# EAGLE design gunboard (EAGLE 9.4.2)
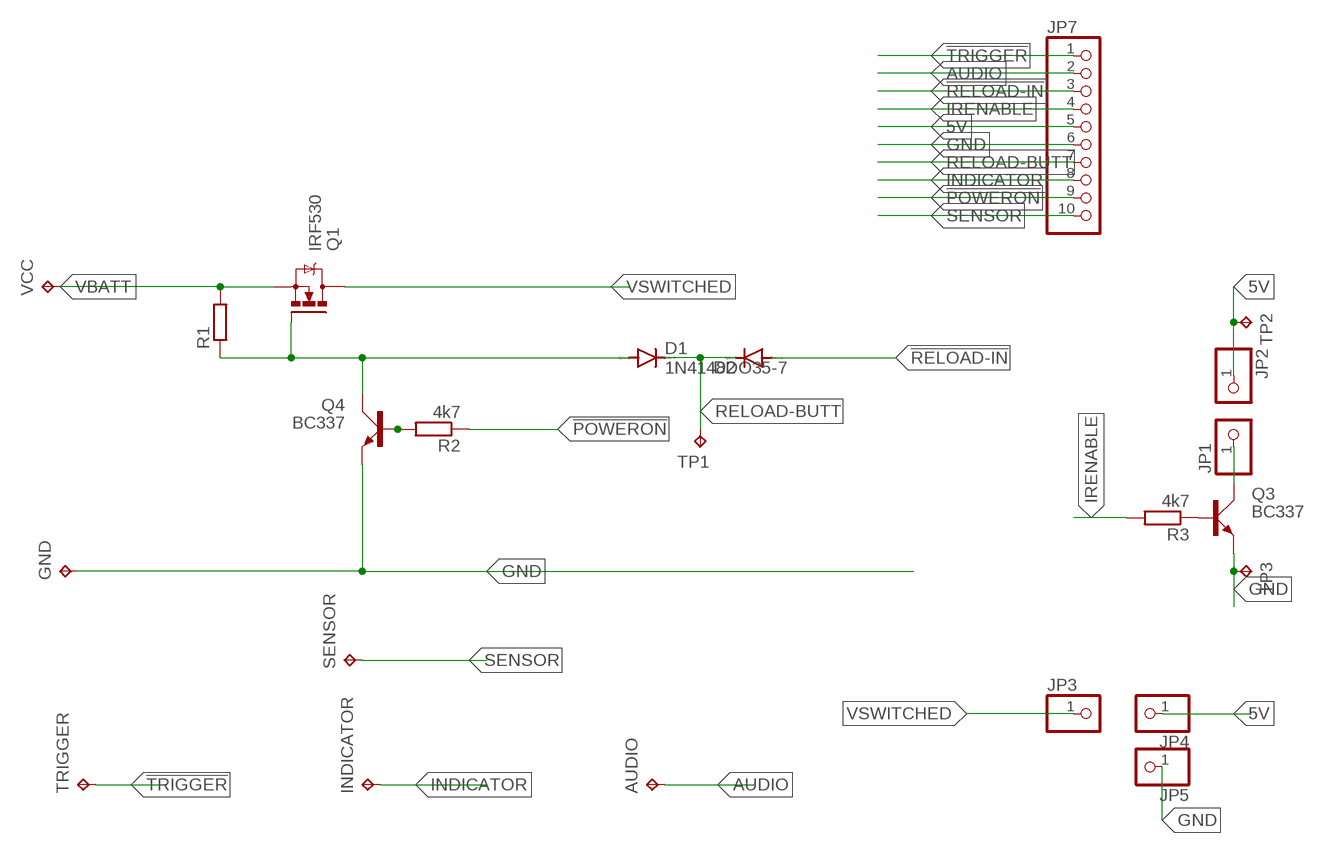
[diagram p0: schematic, sheet 1]

## Parts
AUDIO  TPTP20SQ  [TP20SQ]
D1  1N4148DO35-7  [DO35-7]
D2  DIODE-DO35-10  [DO35-10]
GND  TPTP20SQ  [TP20SQ]
INDICATOR  TPTP20SQ  [TP20SQ]
JP1  PINHD-1X1  [1X01]
JP2  PINHD-1X1  [1X01]
JP3  PINHD-1X1  [1X01]
JP4  PINHD-1X1  [1X01]
JP5  PINHD-1X1  [1X01]
JP7  PINHD-1X10  [1X10]
Q1  IRF530  [TO220BV]
Q3  BC337  [SOT54A]
Q4  BC337  [SOT54A]
R1  R-EU_0207/5V  [0207/5V]
R2  4k7  R-EU_0207/10  [0207/10]
R3  4k7  R-EU_0207/10  [0207/10]
SENSOR  TPTP20SQ  [TP20SQ]
TP1  TPTP20SQ  [TP20SQ]
TP2  TPTP20SQ  [TP20SQ]
TP3  TPTP20SQ  [TP20SQ]
TRIGGER  TPTP20SQ  [TP20SQ]
VCC  TPTP20SQ  [TP20SQ]

## Nets
5V: JP2.1 JP4.1 JP7.5 TP2.TP
!POWERON: JP7.9 R2.1
!RELOAD-IN: D2.A JP7.3
!TRIGGER: JP7.1 TRIGGER.TP
AUDIO: AUDIO.TP JP7.2
GND: GND.TP JP5.1 JP7.6 Q3.E Q4.E TP3.TP
INDICATOR: INDICATOR.TP JP7.8
IRENABLE: JP7.4 R3.2
N$1: JP1.1 Q3.C
N$2: D1.A Q1.G Q4.C R1.1
N$3: Q3.B R3.1
N$4: Q4.B R2.2
RELOAD-BUTT: D1.C D2.C JP7.7 TP1.TP
SENSOR: JP7.10 SENSOR.TP
VBATT: Q1.S R1.2 VCC.TP
VSWITCHED: JP3.1 Q1.D

## Library data of the parts
AUDIO GND INDICATOR SENSOR TP1-TP3 TRIGGER VCC = testpad:TP: Test pad
D1 = diode:1N4148: DIODE high speed (Philips)
D2 = diode:DIODE-: DIODE
JP1-JP5 = pinhead:PINHD-1X1: PIN HEADER
JP7 = pinhead:PINHD-1X10: PIN HEADER
Q1 = transistor-power:IRF530: HEXFET Power MOSFET
Q3 Q4 = transistor-small-signal:BC337: NPN TRANSISTOR
R1-R3 = resistor:R-EU_: RESISTOR, European symbol

## Board
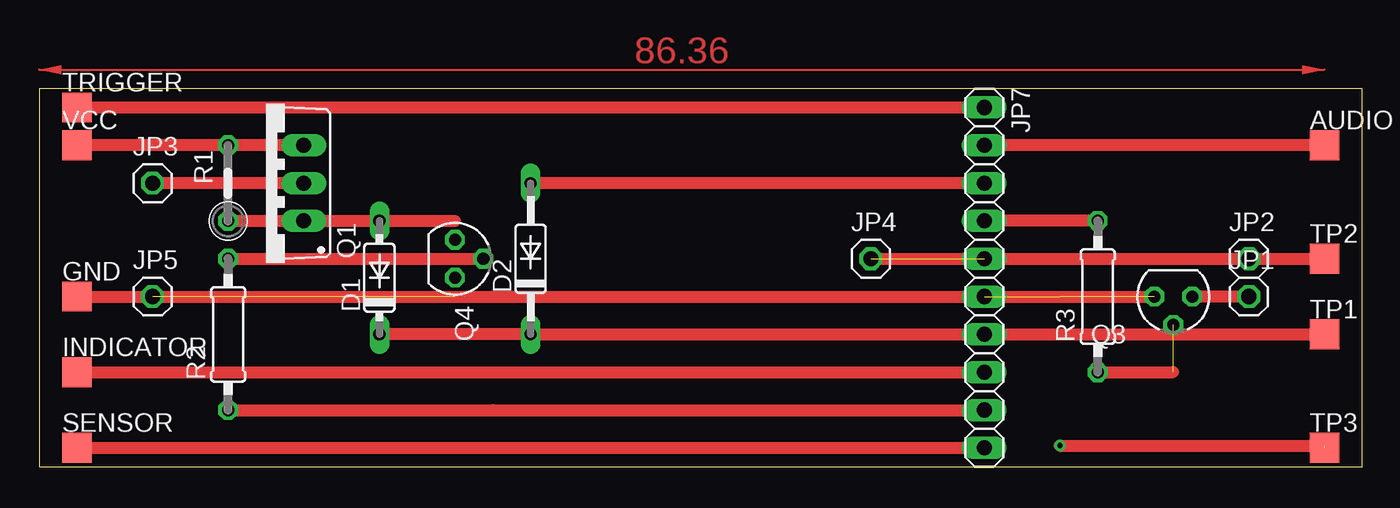
[diagram p1: board, top side]
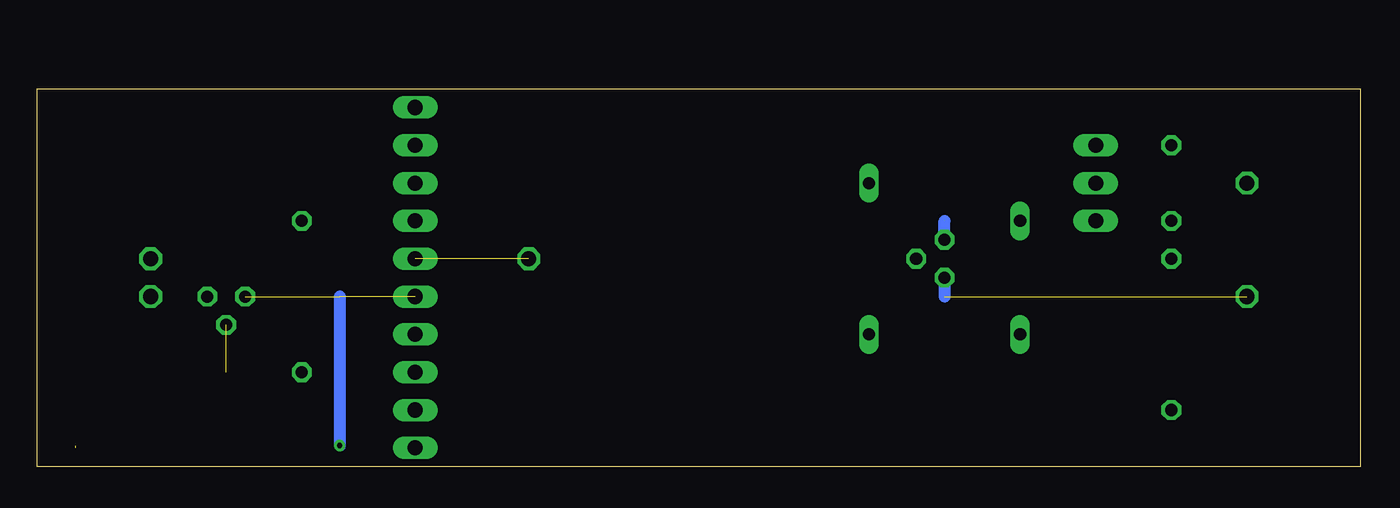
[diagram p2: board, bottom side, seen from below]

Size 88.9 x 25.4 mm. Coordinates in mm from the lower left corner, seen from the top.
Outline: 0,0 88.9,0 88.9,25.4 0,25.4 0,0
Copper layers (1*16): Top 0.035mm / dielectric 1.5mm / Bottom 0.035mm
Design rules "default": minimum track width 6mil, minimum drill 0.35mm, track to track 6mil, track to pad 6mil, pad to pad 6mil, via to via 6mil, smd to smd 6mil, copper to edge 40mil, drill to drill 6mil, minimum pad ring 10mil, minimum via ring 8mil, stop-mask expansion 4mil, vias tented up to drill 0mil, thermal gap 10mil

### Footprints (pad centres in the part's own frame; a part is rotated, then mirrored left to right if it is on the bottom)
TP20SQ = smd 2 x 2: TP 0,0
DO35-7 = drill 0.813 long: A 3.81,0; C -3.81,0
DO35-10 = drill 0.813 long: A 5.08,0; C -5.08,0
1X01 = drill 1.016 octagon: 1 0,0
1X10 = drill 1.016 long: 1 -11.43,0; 2 -8.89,0; 3 -6.35,0; 4 -3.81,0; 5 -1.27,0; 6 1.27,0; 7 3.81,0; 8 6.35,0; 9 8.89,0; 10 11.43,0
TO220BV = drill 1.016 long: D 0,-2.54; G -2.54,-2.54; S 2.54,-2.54
SOT54A = drill 0.813 octagon: B 0,1.905; C -1.27,0; E 1.27,0
0207/5V = drill 0.813 octagon: 1 -2.54,0; 2 2.54,0
0207/10 = drill 0.813 octagon: 1 -5.08,0; 2 5.08,0

### Placement (x,y rotation side)
AUDIO  86.36,21.59 0 top
D1  22.86,12.7 90 top
D2  33.02,13.97 90 top
GND  2.54,11.43 0 top
INDICATOR  2.54,6.35 0 top
JP1  81.28,11.43 0 top
JP2  81.28,13.97 0 top
JP3  7.62,19.05 0 top
JP4  55.88,13.97 0 top
JP5  7.62,11.43 0 top
JP7  63.5,12.7 270 top
Q1  15.24,19.05 90 top
Q3  76.2,11.43 180 top
Q4  27.94,13.97 270 top
R1  12.7,19.05 90 top
R2  12.7,8.89 90 top
R3  71.12,11.43 90 top
SENSOR  2.54,1.27 0 top
TP1  86.36,8.89 0 top
TP2  86.36,13.97 0 top
TP3  86.36,1.27 0 top
TRIGGER  2.54,24.13 0 top
VCC  2.54,21.59 0 top

### Tracks (layer width: path | path; a pad name or v marks a point on that pad's centre or on a via)
5V  (1 unrouted)
  Top 0.813: JP4.1 JP2.1 TP2.TP
!POWERON
  Top 0.813: JP7.9 R2.1 30.48,3.81
!RELOAD-IN
  Top 0.813: JP7.3 D2.A
!TRIGGER
  Top 0.813: TRIGGER.TP JP7.1
AUDIO
  Top 0.813: AUDIO.TP JP7.2
GND  (via drill 0.35)  (4 unrouted)
  Top 0.813: Q3.E JP5.1 GND.TP | v68.58,1.42 86.36,1.42
  Bottom 0.813: Q4.E 27.94,11.43 | 68.58,11.43 v68.58,1.42
INDICATOR
  Top 0.813: INDICATOR.TP JP7.8
IRENABLE
  Top 0.813: R3.2 JP7.4
N$1
  Top 0.813: JP1.1 Q3.C
N$2  (1 unrouted)
  Top 0.813: R1.1 Q1.G D1.A 27.94,16.51
  Bottom 0.813: Q4.C 27.94,16.51
N$3  (1 unrouted)
  Top 0.813: R3.1 76.2,6.35
N$4
  Top 0.813: R2.2 Q4.B
RELOAD-BUTT
  Top 0.813: D1.C D2.C TP1.TP JP7.7
SENSOR
  Top 0.813: SENSOR.TP JP7.10
VBATT
  Top 0.813: VCC.TP R1.2 Q1.S
VSWITCHED
  Top 0.813: Q1.D JP3.1
(copper drawn outside any net)
  shapes: Top area x1

### Text on the board
Holes: X | X | X | X | X | X
Document: don't forget to jumper around / the cuts in tracks 1 & 10 | from VOUT+ on / boost board | to VIN+ on / boost board | to VIN- on / boost board